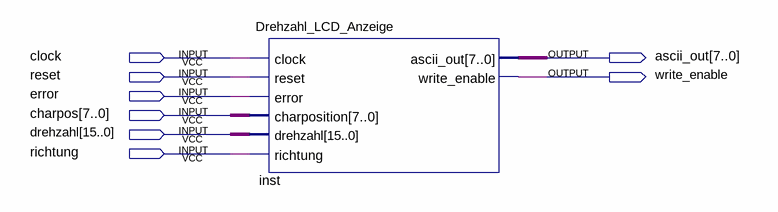
[diagram p0: schematic sheet]
// Quartus schematic LCD_Anzeige_Block.bdf as structural Verilog: 1 symbols, 8 pins
module LCD_Anzeige_Block (
  input  clock,
  input  reset,
  input  error,
  input  [7:0] charpos,
  input  [15:0] drehzahl,
  input  richtung,
  output [7:0] ascii_out,
  output write_enable
);

  Drehzahl_LCD_Anzeige inst (
    .clock(clock), .reset(reset), .error(error), .charposition(charpos), .drehzahl(drehzahl),
    .richtung(richtung), .ascii_out(ascii_out), .write_enable(write_enable));
endmodule
